# EAGLE schematic Spannungsversorgung-3 (EAGLE 7.4.0)
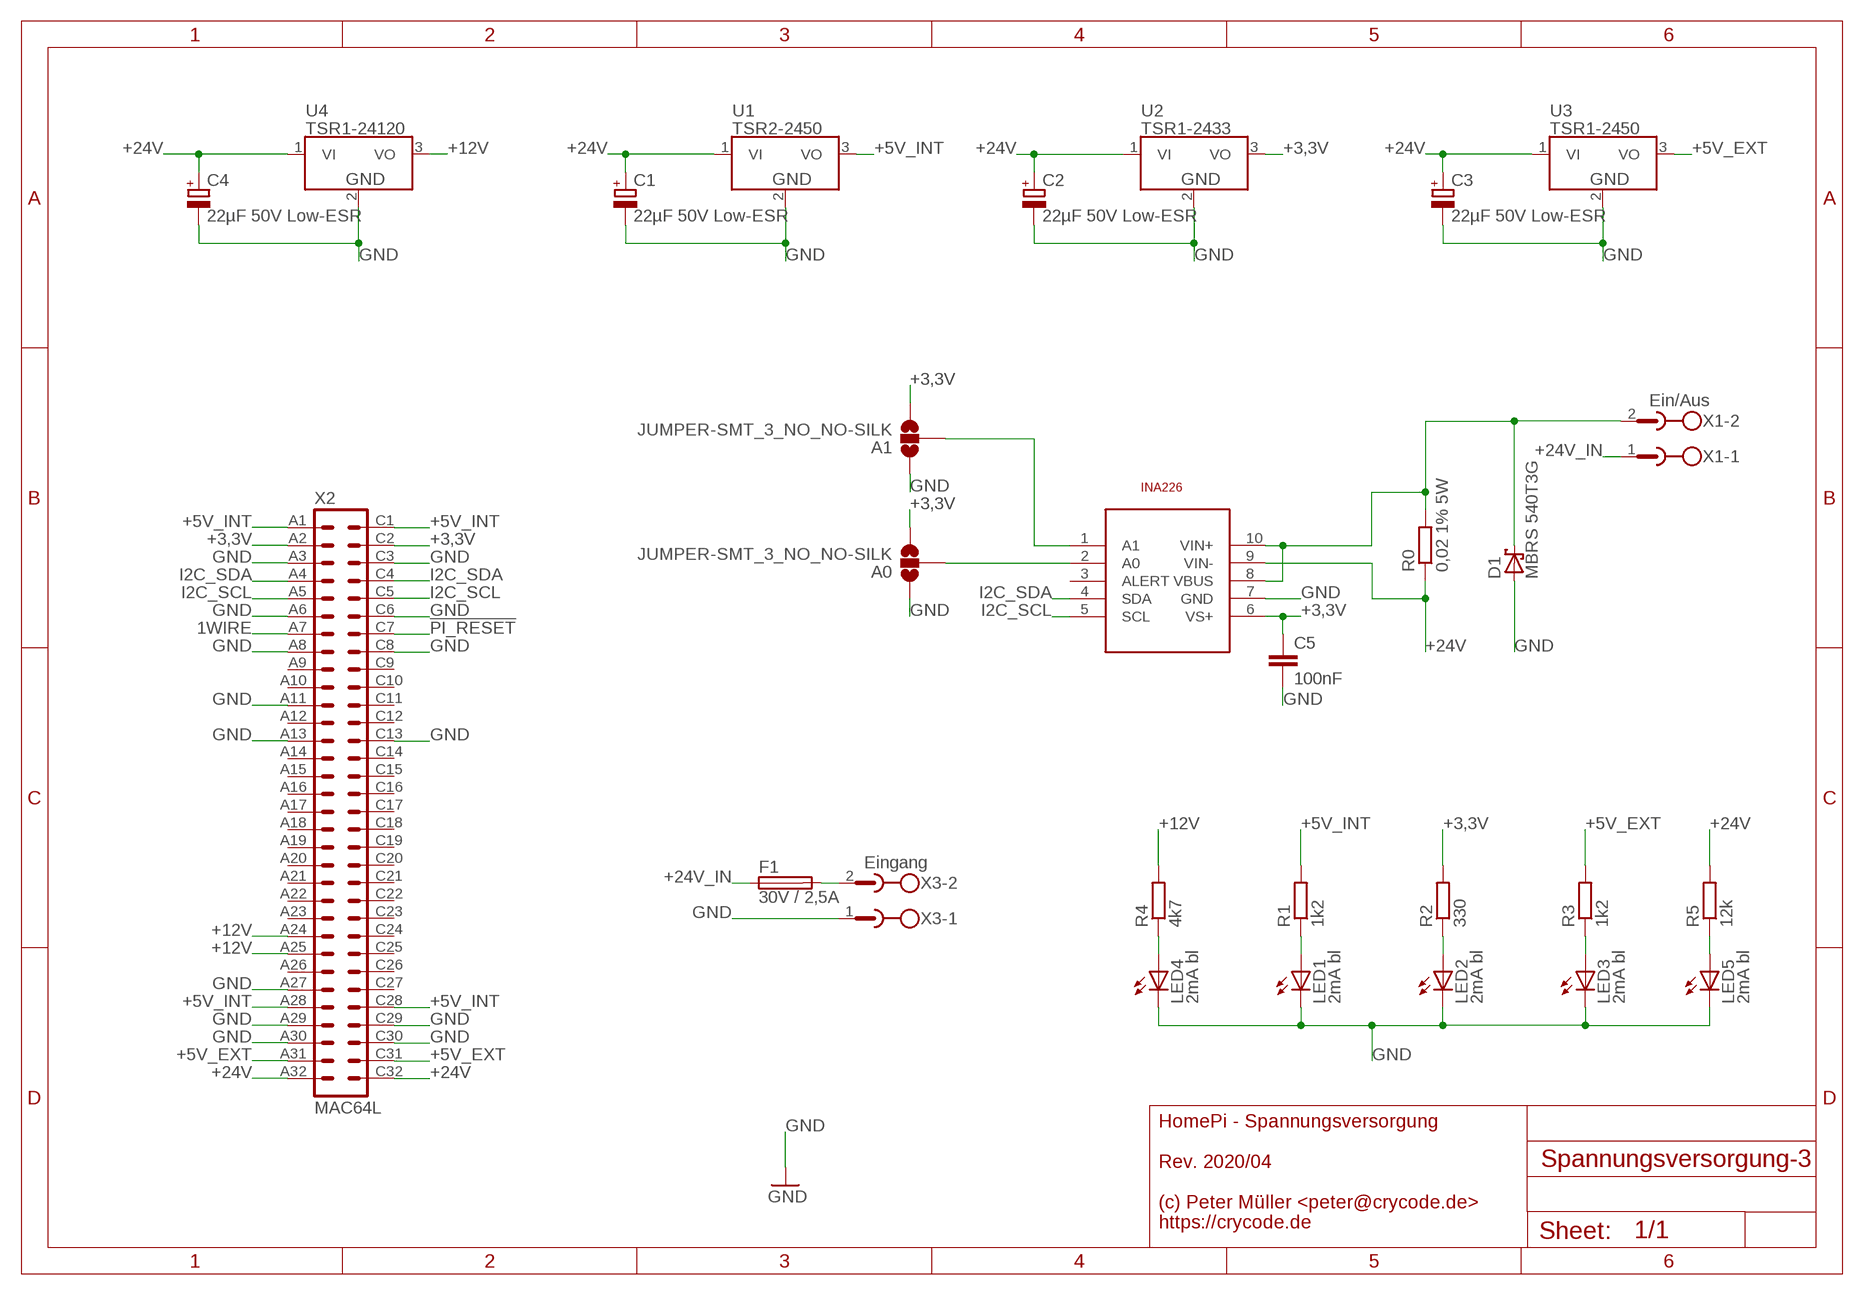
[diagram p0: schematic, sheet 1]

## Parts
A0  JUMPER-SMT_3_NO_NO-SILK  [SMT-JUMPER_3_NO_NO-SILK]
A1  JUMPER-SMT_3_NO_NO-SILK  [SMT-JUMPER_3_NO_NO-SILK]
C1  22µF 50V Low-ESR  CPOL-EUE2-5  [E2-5]
C2  22µF 50V Low-ESR  CPOL-EUE2-5  [E2-5]
C3  22µF 50V Low-ESR  CPOL-EUE2-5  [E2-5]
C4  22µF 50V Low-ESR  CPOL-EUE2-5  [E2-5]
C5  100nF  C-EUC1206  [C1206]
D1  MBRS 540T3G  SCHOTTKY-DIODESMC  [SMC]
F1  30V / 2,5A  LITTLEFUSE  [LITTLEFUSE]
IC1  TI-INA226  [TI-INA226]
LED1  2mA bl  LEDCHIPLED_1206  [CHIPLED_1206]
LED2  2mA bl  LEDCHIPLED_1206  [CHIPLED_1206]
LED3  2mA bl  LEDCHIPLED_1206  [CHIPLED_1206]
LED4  2mA bl  LEDCHIPLED_1206  [CHIPLED_1206]
LED5  2mA bl  LEDCHIPLED_1206  [CHIPLED_1206]
R0  0,02 1% 5W  R-EU_R2512  [R2512]
R1  1k2  R-EU_R1206  [R1206]
R2  330  R-EU_R1206  [R1206]
R3  1k2  R-EU_R1206  [R1206]
R4  4k7  R-EU_R1206  [R1206]
R5  12k  R-EU_R1206  [R1206]
U1  TSR2-2450  [TSR2]
U2  TSR1-2433  [TSR1]
U3  TSR1-2450  [TSR1]
U4  TSR1-24120  [TSR1]
X1  Ein/Aus  MSTBA2  [MSTBA2]
X2  MAC64L  [MAC64L]
X3  Eingang  MSTBA2  [MSTBA2]

## Nets
1WIRE: X2.A7
!PI_RESET: X2.C7
+3,3V: A0.3 A1.3 C5.1 IC1.6(VS+) R2.2 U2.3(VO) X2.A2 X2.C2
+5V_EXT: R3.2 U3.3(VO) X2.A31 X2.C31
+5V_INT: R1.2 U1.3(VO) X2.A1 X2.A28 X2.C1 X2.C28
+12V: R4.2 U4.3(VO) X2.A24 X2.A25
+24V [24V]: C1.+ C2.+ C3.+ C4.+ IC1.9(VIN-) R0.1 R5.2 U1.1(VI) U2.1(VI) U3.1(VI) U4.1(VI) X2.A32 X2.C32
+24V_1 [24V]: D1.C IC1.8(VBUS) IC1.10(VIN+) R0.2 X1.2
+24V_IN: F1.1 X1.1
+24V_IN_RAW: F1.2 X3.2
GND: A0.1 A1.1 C1.- C2.- C3.- C4.- C5.2 D1.A IC1.7(GND) LED1.C LED2.C LED3.C LED4.C LED5.C U1.2(GND) U2.2(GND) U3.2(GND) U4.2(GND) X2.A3 X2.A6 X2.A8 X2.A11 X2.A13 X2.A27 X2.A29 X2.A30 X2.C3 X2.C6 X2.C8 X2.C13 X2.C29 X2.C30 X3.1
I2C_SCL: IC1.5(SCL) X2.A5 X2.C5
I2C_SDA: IC1.4(SDA) X2.A4 X2.C4
N$1: A0.2 IC1.2(A0)
N$2: A1.2 IC1.1(A1)
N$3: LED5.A R5.1
N$6: LED1.A R1.1
N$7: LED2.A R2.1
N$8: LED3.A R3.1
N$9: LED4.A R4.1
Unconnected: IC1.3(ALERT) X2.A9 X2.A10 X2.A12 X2.A14 X2.A15 X2.A16 X2.A17 X2.A18 X2.A19 X2.A20 X2.A21 X2.A22 X2.A23 X2.A26 X2.C9 X2.C10 X2.C11 X2.C12 X2.C14 X2.C15 X2.C16 X2.C17 X2.C18 X2.C19 X2.C20 X2.C21 X2.C22 X2.C23 X2.C24 X2.C25 X2.C26 X2.C27

## Notes on the sheet
- HomePi - Spannungsversorgung
  
  Rev. 2020/04
  
  (c) Peter Müller <peter@crycode.de>
  https://crycode.de

## Library data of the parts
A0 A1 = SparkFun-Jumpers:JUMPER-SMT_3_NO: Normally open jumper This jumper has three pads in close proximity to each other. Apply solder to close the connection(s).
C1-C4 = rcl:CPOL-EU: POLARIZED CAPACITOR, European symbol
C5 = rcl:C-EU: CAPACITOR, European symbol
D1 = diode:SCHOTTKY-DIODE: Schottky Diode
F1 = fuse:LITTLEFUSE: LITTLEFUSE Picofuse/slow Littlefuse; OC_FARNELL: unknown; OC_NEWARK: unknown
IC1 = FaBo-Sensor:TI-INA226
LED1-LED5 = led:LED: LED OSRAM: - CHIPLED LG R971, LG N971, LY N971, LG Q971, LY Q971, LO R971, LY R971 LH N974, LH R974 LS Q976, LO Q976, LY Q976 LO Q996 - Hyper CHIPLED LW Q18S LB Q993, LB Q99A, LB R99A - SideLED LS A670, LO A670, LY A670, LG A670, LP A670 LB A673, LV A673, LT A673, LW A673 LH A674 LY A675 LS A676, LA A676, LO A676, LY A676, LW A676 LS A679, LY A679, LG A679 - Hyper Micro SIDELED® LS Y876, LA Y876, LO Y876, LY Y876 LT Y87S - SmartLED LW L88C, LW L88S LB L89C, LB L89S, LG L890 LS L89K, LO L89K, LY L89K LS L896, LA L896, LO L896, LY L896 - TOPLED LS T670, LO T670, LY T670, LG T670, LP T670 LSG T670, LSP T670, LSY T670, LOP T670, LYG T670 LG T671, LOG T671, LSG T671 LB T673, LV T673, LT T673, LW T673 LH T674 LS T676, LA T676, LO T676, LY T676, LB T676, LH T676, LSB T676, LW T676 LB T67C, LV T67C, LT T67C, LS T67K, LO T67K, LY T67K, LW E67C LS E67B, LA E67B, LO E67B, LY E67B, LB E67C, LV E67C, LT E67C LW T67C LS T679, LY T679, LG T679 LS T770, LO T770, LY T770, LG T770, LP T770 LB T773, LV T773, LT T773, LW T773 LH T774 LS E675, LA E675, LY E675, LS T675 LS T776, LA T776, LO T776, LY T776, LB T776 LHGB T686 LT T68C, LB T68C - Hyper Mini TOPLED® LB M676 - Mini TOPLED Santana® LG M470 LS M47K, LO M47K, LY M47K Source: http://www.osram.convergy.de LUXEON: - LUMILED® LXK2-PW12-R00, LXK2-PW12-S00, LXK2-PW14-U00, LXK2-PW14-V00 LXK2-PM12-R00, LXK2-PM12-S00, LXK2-PM14-U00 LXK2-PE12-Q00, LXK2-PE12-R00, LXK2-PE12-S00, LXK2-PE14-T00, LXK2-PE14-U00 LXK2-PB12-K00, LXK2-PB12-L00, LXK2-PB12-M00, LXK2-PB14-N00, LXK2-PB14-P00, LXK2-PB14-Q00 LXK2-PR12-L00, LXK2-PR12-M00, LXK2-PR14-Q00, LXK2-PR14-R00 LXK2-PD12-Q00, LXK2-PD12-R00, LXK2-PD12-S00 LXK2-PH12-R00, LXK2-PH12-S00 LXK2-PL12-P00, LXK2-PL12-Q00, LXK2-PL12-R00 Source: www.luxeon.com KINGBRIGHT: KA-3528ASYC Source: www.kingbright.com
R0 R1-R5 = rcl:R-EU_: RESISTOR, European symbol
U1 = TSR:TSR2-*: TSR 2 Series, 1 A The new TSR 2 series step-down switching regulators are drop-in replacement for inefficient LMxx linear regulators. A high efficiency up to 96 % allows full load operation up to +67°C ambient temperature without the need of any heat-sink or forced cooling.The TSR 2 switching regulators provide other significant features over linear regulators, i.e. better output accuracy (±2 %), lower standby current of 2 mA and no requirement of external capacitors. The high efficiency and low standby power consumption makes these regulators an ideal solution for many battery powered applications.
U2-U4 = TSR:TSR1-*: TSR 1 Series, 1 Amp The TSR-1 series step-down switching regulators are drop-in replacement for inefficient 78xx linear regulators. A high efficiency up to 96 % allows full load operation up to +60 °C ambient temperature without the need of any heat-sink or forced cooling. The TSR-1 switching regulators provide other significant fea-tures over linear regulators, i.e. better output accuracy (±2 %), lower standby current of 2 mA and no requirement of external capacitors. The high efficiency and low standby power consumption makes these regulators an ideal solution for many battery powered applications.
X1 X3 = con-phoenix-508:MSTBA2: PHOENIX; MF: FARNELL; MPN: 1757242; OC_FARNELL: 3705171; OC_NEWARK: 71C4161
X2 = con-vg:MAC64L: CONNECTOR male, 64 pins, block, type C, rows AC, grid 5.08 mm

## Net classes
1 24V: clearance 0.406 mm